# Altium schematic sheet PA.SchDoc
size A4; SheetNumber: 3; SheetTotal: 4
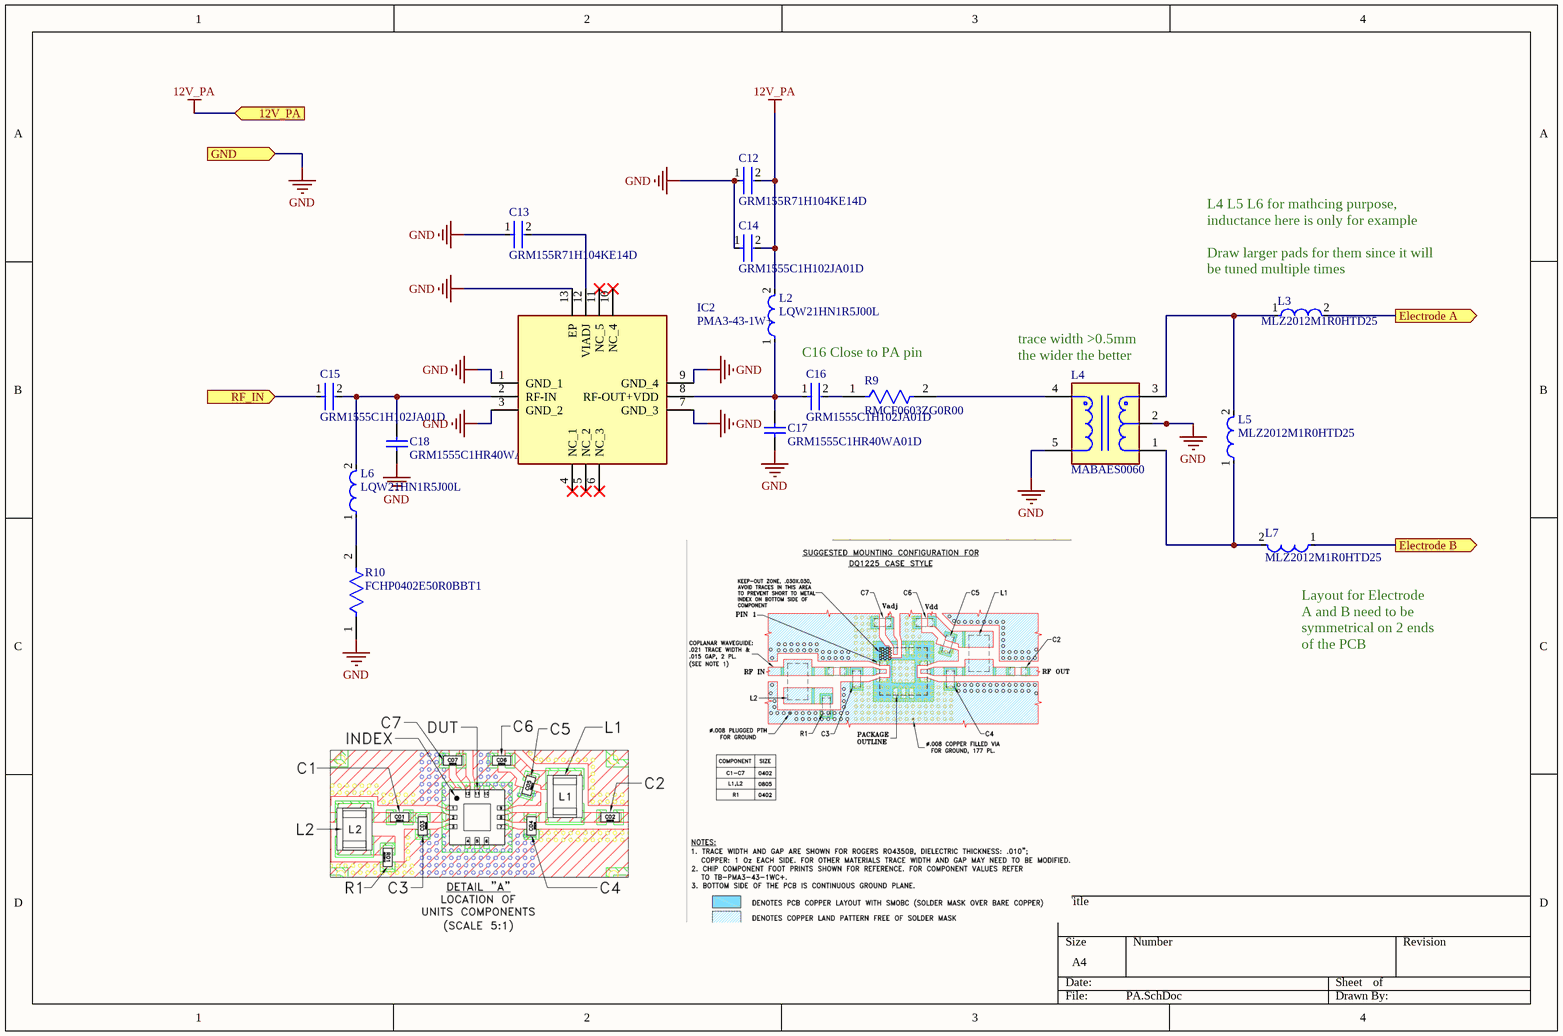
[diagram p0: PA.SchDoc]

## Parts
C12  GRM155R71H104KE14D  [FP-GRM155-0_05-IPC_B]
C13  GRM155R71H104KE14D  [FP-GRM155-0_05-IPC_B]
C14  GRM1555C1H102JA01D  [FP-GRM155-0_05-IPC_B]
C15  GRM1555C1H102JA01D  [FP-GRM155-0_05-IPC_B]
C16  GRM1555C1H102JA01D  [FP-GRM155-0_05-IPC_B]
C17  GRM1555C1HR40WA01D  [CAPC1005X55X25LL05T10]
C18  GRM1555C1HR40WA01D  [CAPC1005X55X25LL05T10]
IC2  PMA3-43-1W+  [QFN51P300X300X89-13N]
L2  LQW21HN1R5J00L  [FP-LQW21HN_00-MFG]
L3  MLZ2012M1R0HTD25  [FP-MLZ2012-1_25-IPC_C]
L4  MABAES0060  [FP-MABAES0060-MFG]
L5  MLZ2012M1R0HTD25  [FP-MLZ2012-1_25-IPC_C]
L6  LQW21HN1R5J00L  [FP-LQW21HN_00-MFG]
L7  MLZ2012M1R0HTD25  [FP-MLZ2012-1_25-IPC_C]
R9  RMCF0603ZG0R00  [FP-RMCF0603-IPC_B]
R10  FCHP0402E50R0BBT1  [FP-FC0402-MFG]

## Ports
12V_PA (in), Electrode A (out), Electrode B (out), GND (in), RF_IN (in)

## Nets
12V_PA: C12.2 C14.2 L2.2 ; port 12V_PA
GND: C12.1 C13.1 C14.1 C17.1 C18.1 IC2.1(GND_1) IC2.3(GND_2) IC2.7(GND_3) IC2.9(GND_4) IC2.13(EP) L4.2(Secondary_CT) L4.5(Primary) R10.1 ; port GND
Electrode A: L3.2 ; port Electrode A
Electrode B: L7.1 ; port Electrode B
RF_IN: C15.1 ; port RF_IN
NetC13_2: C13.2 IC2.12(VIADJ)
NetC15_2: C15.2 C18.2 IC2.2(RF-IN) L6.2
NetC16_1: C16.1 C17.2 IC2.8(RF-OUT+VDD) L2.1
NetC16_2: C16.2 R9.1
NetL3_1: L3.1 L4.3(Secondary_Dot) L5.2
NetL4_1: L4.1(Secondary) L5.1 L7.2
NetL4_4: L4.4(Primary_dot) R9.2
NetL6_1: L6.1 R10.2

Not connected (* = marked no-connect by the designer): IC2 4(NC_1)* 5(NC_2)* 6(NC_3)* 10(NC_4)* 11(NC_5)*

## Notes on the sheet
- (near L3) L4 L5 L6 for mathcing purpose, inductance here is only for example
  Draw larger pads for them since it will be tuned multiple times
- C16 Close to PA pin
- (near L4) trace width >0.5mm the wider the better
- (near L7) Layout for Electrode A and B need to be symmetrical on 2 ends of the PCB

## Library data of the parts
C12 C13 = CMP-2008-04639-2: Chip Multilayer Ceramic Capacitors for General Purpose, 0402, 0.10uF, X7R, 15%, 10%, 50V; Dissipation Factor: 0.025%; Capacitance: 100nF; Weight: 0.000212oz; Thickness: 0.022inch; Voltage Rating (DC): 50V; Dielectric Material: Ceramic; Termination: SMD/SMT; Case/Package: 0402; Case Code (Imperial): 0402; Mount: Surface Mount; REACH SVHC: No SVHC; Resistor Type: Ceramic; Dielectric: X7R; Max Operating Temperature: 125°C; Voltage: 50V; Lead Free: Lead Free; Package Quantity: 10000; Packaging: Tape and Reel; Length: 1mm; Material: Ceramic; Height: 0.5mm; Depth: 0.5mm; Width: 0.5mm; Min Operating Temperature: -55°C; Tolerance: 10%; Case Code (Metric): 1005; Voltage Rating: 50V
C14-C16 = CMP-2008-04254-2: Chip Multilayer Ceramic Capacitors for General Purpose, 0402, 1000pF, C0G, 30ppm/°C, 5%, 50V; Insulation Resistance: 10GR; Capacitance: 1nF; Packaging: Tape and Reel; Lead Free: Lead Free; Tolerance: 5%; Temperature Coefficient: 30ppm/°C; Thickness: 0.022inch; Termination: SMD/SMT; Max Operating Temperature: 125°C; Height: 0.5mm; Package Quantity: 1; Radiation Hardening: No; Material: Ceramic; Case Code (Metric): 1005; Number of Pins: 2; Voltage Rating: 50V; Mount: Surface Mount; Voltage: 50V; Case/Package: 0402; Min Operating Temperature: -55°C; Dielectric Material: Ceramic; Width: 0.5mm; Depth: 0.5mm; Case Code (Imperial): 0402; REACH SVHC: No SVHC; Dielectric: C0G; Voltage Rating (DC): 50V; Length: 1mm
C17 C18 = CMP-1034-00010-2: Manufacturer: Murata; Part Number: GRM1555C1HR40WA01D
IC2 = PMA3-43-1W+: Integrated Circuit; Manufacturer_Name: Mini-Circuits; Datasheet Link: https://www.minicircuits.com/pdfs/PMA3-43-1W+.pdf; Height: 0.89mm; Manufacturer_Part_Number: PMA3-43-1W+
L2 L6 = CMP-06042-001639-1: Wire Wound Ferrite type RF Inuctor 1.5uH ±5% 85mA 5.33Ω 0805 (2012); DC Resistance (DCR): 5.33R; Self Resonant Frequency: 350MHz; Shielding: Unshielded; Test Frequency: 10MHz; Q Factor: 35; Width: 0.047inch; Core Material: Ferrite; Case Code (Metric): 2012; DC Current: 85mA; Current Rating: 85mA; Mount: Surface Mount; Max DC Current: 85mA; Length: 2mm; Height - Seated (Max): 0.039inch; Depth: 1.4mm; Min Operating Temperature: -40°C; Termination: SMD/SMT; Military Standard: Not; Radiation Hardening: No; Packaging: Tape and Reel; Resistor Type: Wirewound; Case/Package: 0805; Case Code (Imperial): 0805; Inductance: 1.5uH; Weight: 0.000282oz; Height: 0.9mm; Package Quantity: 3000; Max Operating Temperature: 85°C; Tolerance: 5%
L3 L5 L7 = CMP-08253-000383-1: Shielded Multilayer Inductor 1uH ±20% 800mA 130mΩ AEC-Q200 SMD 0805; Core Material: Ferrite; Test Frequency: 2MHz; DC Resistance (DCR): 130mR; Saturation Current: 700mA; Height: 1.25mm; Min Operating Temperature: -55°C; Max DC Current: 800mA; Mount: Surface Mount; Height - Seated (Max): 0.057inch; Tolerance: 20%; Package Quantity: 2000; Case/Package: 0805; Current Rating: 800mA; Inductance: 1uH; Case Code (Metric): 2012; Max Operating Temperature: 125°C; RoHS Compliant: Yes; Case Code (Imperial): 0805; Shielding: Shielded; Ratings: AEC-Q200; Length: 0.079inch; Termination: SMD/SMT; Packaging: Tape and Reel; Width: 0.049inch; Weight: 0.000194oz
L4 = CMP-97513-000003-1: BALUN 300KHZ-200MHZ 1:1 6SMD; Insertion Loss: 1.5dB; Lead/Base Style: Gull Wing; Max DC Current: 500mA; Power Rating: 500mW; Package Quantity: 2000; Lead Free: Lead Free; Case/Package: SMD/SMT; Number of Pins: 5; Width: 3.81mm; Turns Ratio: 1:1; Depth: 3.81mm; Height: 2.67mm; Min Operating Temperature: -40°C; Termination: SMD/SMT; Length: 3.81mm; Max Operating Temperature: 85°C; Packaging: Tape and Reel; Radiation Hardening: No; Mount: Surface Mount
R9 = CMP-26527-006412-1: 0Ω ±0 0.1W 0603 Thick Film Chip Resistor AEC-Q200 compliant; Max Power Dissipation: 100mW; Resistance: 0R; Width: 0.031inch; RoHS Compliant: Yes; Number of Terminations: 2; Case/Package: 0603; Contact Plating: Tin; Height: 0.022inch; Resistor Type: Thick Film; Mount: Surface Mount; Length: 0.061inch; Features: Automotive AEC-Q200; Series: RMCF; Max Operating Temperature: 155°C; Radiation Hardening: No; Min Operating Temperature: -55°C; Packaging: Tape and Reel
R10 = CMP-05494-120702529-1: FCHP0402E50R0BBT1 SMD Chip Resistor, 50 Ohm, ± 0.1%, 1 W, 0402 [1005 Metric], Thin Film, High Frequency; Power Rating: 1W; Voltage Rating: 30V; Temperature Coefficient: 25ppm/°C; Resistance: 50Ω; Max Operating Temperature: 155°C; Min Operating Temperature: -55°C; Composition: Thin Film; Schedule B: 8533210045; Case/Package: 0402; Tolerance: 0.1%; Height: 419.1µm; NexarPartId: 120702529